# Altium project Mach8led.PrjPCB
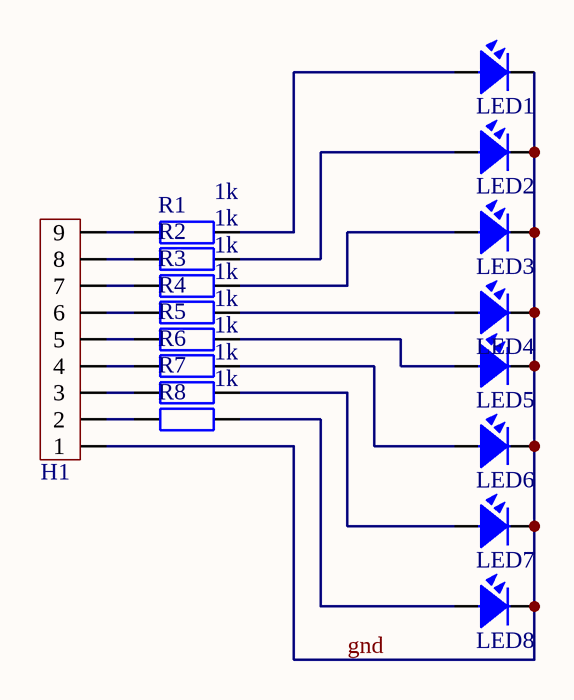
[diagram p0: Pcb8led.SchDoc]
1 sheet, 17 parts. Net scope: global (net labels, ports and power ports of the same name join across sheets).
Board file: PCB8led.PcbDoc

## Sheet Pcb8led.SchDoc
size A3

### Parts
H1  Header9  [Header9]  (value not drawn)
LED1  LED  [LED-3]  (value not drawn)
LED2  LED  [LED-3]  (value not drawn)
LED3  LED  [LED-3]  (value not drawn)
LED4  LED  [LED-3]  (value not drawn)
LED5  LED  [LED-3]  (value not drawn)
LED6  LED  [LED-3]  (value not drawn)
LED7  LED  [LED-3]  (value not drawn)
LED8  LED  [LED-3]  (value not drawn)
R1  1k  [R1/4W]
R2  1k  [R1/4W]
R3  1k  [R1/4W]
R4  1k  [R1/4W]
R5  1k  [R1/4W]
R6  1k  [R1/4W]
R7  1k  [R1/4W]
R8  1k  [R1/4W]

### Nets
gnd: H1.1 LED1.2 LED2.2 LED3.2 LED4.2 LED5.2 LED6.2 LED7.2 LED8.2
NetH1_2: H1.2 R8.1
NetH1_3: H1.3 R7.1
NetH1_4: H1.4 R6.1
NetH1_5: H1.5 R5.1
NetH1_6: H1.6 R4.1
NetH1_7: H1.7 R3.1
NetH1_8: H1.8 R2.1
NetH1_9: H1.9 R1.1
NetLED1_1: LED1.1 R1.2
NetLED2_1: LED2.1 R2.2
NetLED3_1: LED3.1 R3.2
NetLED4_1: LED4.1 R4.2
NetLED5_1: LED5.1 R5.2
NetLED6_1: LED6.1 R6.2
NetLED7_1: LED7.1 R7.2
NetLED8_1: LED8.1 R8.2

### Library data of the parts
H1 = Header9: Header IDC, 9 x 1 Pin Vertical 2.54mm Pitch (Non-Boxed, Male)
LED1-LED8 = LED: LED Single colour Green and Red; Value: LED 3 ly Single Colour
R1-R8 = R1/4W: Resistor 1/4W; Value: R1/4W - 1K